# Altium schematic sheet fpga_sheet.SchDoc
size A4
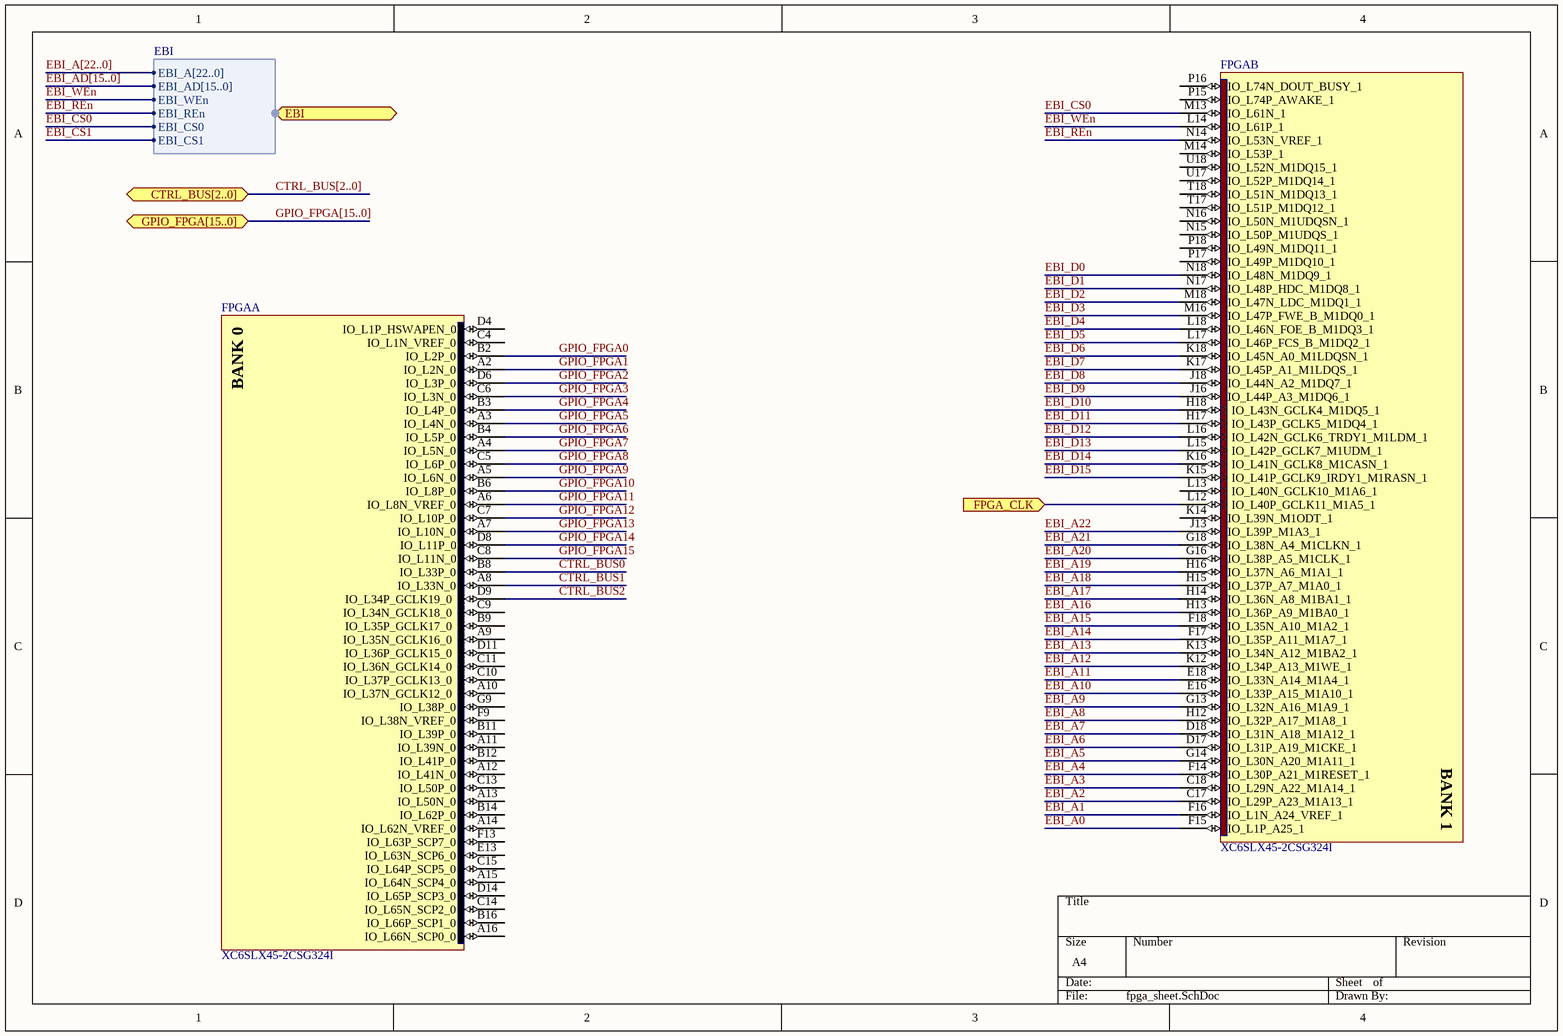
[diagram p0: fpga_sheet.SchDoc]

## Parts
FPGA  XC6SLX45-2CSG324I  [CSG324]  (parts A,B of 8)

## Ports
CTRL_BUS[2..0] (bidir), EBI (harness EBI), FPGA_CLK (in), GPIO_FPGA[15..0] (bidir)

## Harnesses
EBI: EBI_A[22..0], EBI_AD[15..0], EBI_WEn, EBI_REn, EBI_CS0, EBI_CS1

## Nets
CTRL_BUS0: FPGA.B8(IO_L33P_0)
CTRL_BUS1: FPGA.A8(IO_L33N_0)
CTRL_BUS2: FPGA.D9(IO_L34P_GCLK19_0)
EBI_A0: FPGA.F15(IO_L1P_A25_1)
EBI_A1: FPGA.F16(IO_L1N_A24_VREF_1)
EBI_A2: FPGA.C17(IO_L29P_A23_M1A13_1)
EBI_A3: FPGA.C18(IO_L29N_A22_M1A14_1)
EBI_A4: FPGA.F14(IO_L30P_A21_M1RESET_1)
EBI_A5: FPGA.G14(IO_L30N_A20_M1A11_1)
EBI_A6: FPGA.D17(IO_L31P_A19_M1CKE_1)
EBI_A7: FPGA.D18(IO_L31N_A18_M1A12_1)
EBI_A8: FPGA.H12(IO_L32P_A17_M1A8_1)
EBI_A9: FPGA.G13(IO_L32N_A16_M1A9_1)
EBI_A10: FPGA.E16(IO_L33P_A15_M1A10_1)
EBI_A11: FPGA.E18(IO_L33N_A14_M1A4_1)
EBI_A12: FPGA.K12(IO_L34P_A13_M1WE_1)
EBI_A13: FPGA.K13(IO_L34N_A12_M1BA2_1)
EBI_A14: FPGA.F17(IO_L35P_A11_M1A7_1)
EBI_A15: FPGA.F18(IO_L35N_A10_M1A2_1)
EBI_A16: FPGA.H13(IO_L36P_A9_M1BA0_1)
EBI_A17: FPGA.H14(IO_L36N_A8_M1BA1_1)
EBI_A18: FPGA.H15(IO_L37P_A7_M1A0_1)
EBI_A19: FPGA.H16(IO_L37N_A6_M1A1_1)
EBI_A20: FPGA.G16(IO_L38P_A5_M1CLK_1)
EBI_A21: FPGA.G18(IO_L38N_A4_M1CLKN_1)
EBI_A22: FPGA.J13(IO_L39P_M1A3_1)
EBI_CS0: FPGA.M13(IO_L61N_1) ; port EBI.EBI_CS0
EBI_CS1: port EBI.EBI_CS1
EBI_D0: FPGA.N18(IO_L48N_M1DQ9_1)
EBI_D1: FPGA.N17(IO_L48P_HDC_M1DQ8_1)
EBI_D2: FPGA.M18(IO_L47N_LDC_M1DQ1_1)
EBI_D3: FPGA.M16(IO_L47P_FWE_B_M1DQ0_1)
EBI_D4: FPGA.L18(IO_L46N_FOE_B_M1DQ3_1)
EBI_D5: FPGA.L17(IO_L46P_FCS_B_M1DQ2_1)
EBI_D6: FPGA.K18(IO_L45N_A0_M1LDQSN_1)
EBI_D7: FPGA.K17(IO_L45P_A1_M1LDQS_1)
EBI_D8: FPGA.J18(IO_L44N_A2_M1DQ7_1)
EBI_D9: FPGA.J16(IO_L44P_A3_M1DQ6_1)
EBI_D10: FPGA.H18(IO_L43N_GCLK4_M1DQ5_1)
EBI_D11: FPGA.H17(IO_L43P_GCLK5_M1DQ4_1)
EBI_D12: FPGA.L16(IO_L42N_GCLK6_TRDY1_M1LDM_1)
EBI_D13: FPGA.L15(IO_L42P_GCLK7_M1UDM_1)
EBI_D14: FPGA.K16(IO_L41N_GCLK8_M1CASN_1)
EBI_D15: FPGA.K15(IO_L41P_GCLK9_IRDY1_M1RASN_1)
EBI_REn: FPGA.N14(IO_L53N_VREF_1) ; port EBI.EBI_REn
EBI_WEn: FPGA.L14(IO_L61P_1) ; port EBI.EBI_WEn
FPGA_CLK: FPGA.L12(IO_L40P_GCLK11_M1A5_1) ; port FPGA_CLK
GPIO_FPGA0: FPGA.B2(IO_L2P_0)
GPIO_FPGA1: FPGA.A2(IO_L2N_0)
GPIO_FPGA2: FPGA.D6(IO_L3P_0)
GPIO_FPGA3: FPGA.C6(IO_L3N_0)
GPIO_FPGA4: FPGA.B3(IO_L4P_0)
GPIO_FPGA5: FPGA.A3(IO_L4N_0)
GPIO_FPGA6: FPGA.B4(IO_L5P_0)
GPIO_FPGA7: FPGA.A4(IO_L5N_0)
GPIO_FPGA8: FPGA.C5(IO_L6P_0)
GPIO_FPGA9: FPGA.A5(IO_L6N_0)
GPIO_FPGA10: FPGA.B6(IO_L8P_0)
GPIO_FPGA11: FPGA.A6(IO_L8N_VREF_0)
GPIO_FPGA12: FPGA.C7(IO_L10P_0)
GPIO_FPGA13: FPGA.A7(IO_L10N_0)
GPIO_FPGA14: FPGA.D8(IO_L11P_0)
GPIO_FPGA15: FPGA.C8(IO_L11N_0)

Not connected (* = marked no-connect by the designer): FPGA A9(IO_L35N_GCLK16_0) A10(IO_L37N_GCLK12_0) A11(IO_L39N_0) A12(IO_L41N_0) A13(IO_L50N_0) A14(IO_L62N_VREF_0) A15(IO_L64N_SCP4_0) A16(IO_L66N_SCP0_0) B9(IO_L35P_GCLK17_0) B11(IO_L39P_0) B12(IO_L41P_0) B14(IO_L62P_0) B16(IO_L66P_SCP1_0) C4(IO_L1N_VREF_0) C9(IO_L34N_GCLK18_0) C10(IO_L37P_GCLK13_0) C11(IO_L36N_GCLK14_0) C13(IO_L50P_0) C14(IO_L65N_SCP2_0) C15(IO_L64P_SCP5_0) D4(IO_L1P_HSWAPEN_0) D11(IO_L36P_GCLK15_0) D14(IO_L65P_SCP3_0) E13(IO_L63N_SCP6_0) F9(IO_L38N_VREF_0) F13(IO_L63P_SCP7_0) G9(IO_L38P_0) K14(IO_L39N_M1ODT_1) L13(IO_L40N_GCLK10_M1A6_1) M14(IO_L53P_1) N15(IO_L50P_M1UDQS_1) N16(IO_L50N_M1UDQSN_1) P15(IO_L74P_AWAKE_1) P16(IO_L74N_DOUT_BUSY_1) P17(IO_L49P_M1DQ10_1) P18(IO_L49N_M1DQ11_1) T17(IO_L51P_M1DQ12_1) T18(IO_L51N_M1DQ13_1) U17(IO_L52P_M1DQ14_1) U18(IO_L52N_M1DQ15_1)

## Buses and harness runs
bus CTRL_BUS[2..0] = port CTRL_BUS[2..0]
bus EBI_A[22..0]
bus EBI_AD[15..0]
bus GPIO_FPGA[15..0] = port GPIO_FPGA[15..0]

## Notes on the sheet
- (in symbol XC6SLX45-2CSG324I, part A) BANK 0
- (in symbol XC6SLX45-2CSG324I, part B) BANK 1

## Library data of the parts
FPGA = XC6SLX45-2CSG324I: Spartan-6 LX 1.2V FPGA, 218 User I/Os, 324-Ball Chip-Scale BGA (0.8mm Pitch), Speed Grade 2, Industrial Grade, Pb-Free; DatasheetVersion: ver1.6, Nov-2010; PackageVersion: ver1.1, Nov-2009; PackageReference: CSG324; PackageDescription: 324-Ball Chip-Scale BGA (CSG324) Package, 0.8 mm Pitch; Code_JEDEC: MO-275-KKAC-1; ComponentLink1Description: Manufacturer URL; ComponentLink1URL: http://www.xilinx.com/; ComponentLink2Description: Spartan-6 Datasheet; ComponentLink2URL: http://www.xilinx.com/support/documentation/data_sheets/ds160.pdf; ComponentLink3Description: Spartan-6 Documents; ComponentLink3URL: http://www.xilinx.com/support/documentation/spartan-6.htm